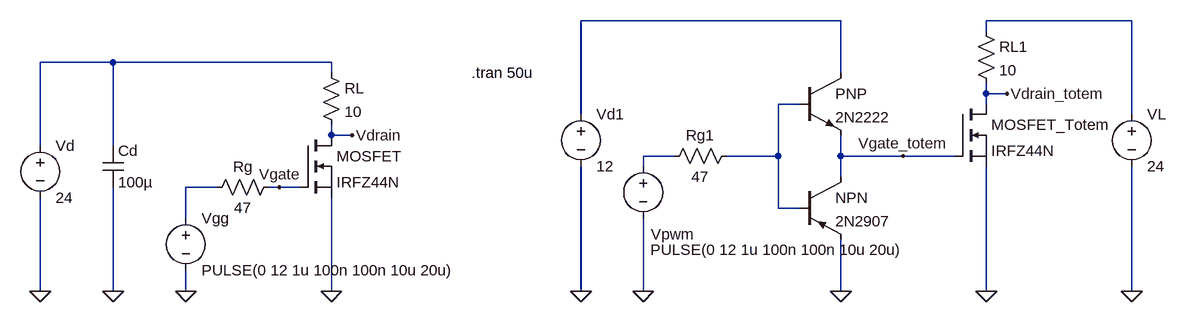
[diagram p0: schematic Prima Nafisman_493817_Task_1.asc]
Prima Nafisman_493817_Task_1.asc, the LTspice schematic file:
Version 4
SHEET 1 6624 680
WIRE 1008 -64 608 -64
WIRE 1456 -64 1232 -64
WIRE 1232 -48 1232 -64
WIRE -112 0 -224 0
WIRE 224 0 -112 0
WIRE 224 16 224 0
WIRE 1008 16 1008 -64
WIRE 1232 48 1232 32
WIRE 1264 48 1232 48
WIRE 944 64 912 64
WIRE 1232 64 1232 48
WIRE 608 80 608 -64
WIRE 1456 80 1456 -64
WIRE 224 112 224 96
WIRE 256 112 224 112
WIRE -224 128 -224 0
WIRE -112 128 -112 0
WIRE 752 144 704 144
WIRE 912 144 912 64
WIRE 912 144 832 144
WIRE 1008 144 1008 112
WIRE 1104 144 1008 144
WIRE 1184 144 1104 144
WIRE 704 160 704 144
WIRE 1008 176 1008 144
WIRE 48 192 0 192
WIRE 144 192 128 192
WIRE 176 192 144 192
WIRE 912 224 912 144
WIRE 944 224 912 224
WIRE 0 240 0 192
WIRE -224 352 -224 208
WIRE -112 352 -112 192
WIRE 0 352 0 320
WIRE 224 352 224 208
WIRE 608 352 608 160
WIRE 704 352 704 240
WIRE 1008 352 1008 272
WIRE 1232 352 1232 160
WIRE 1456 352 1456 160
FLAG 224 352 0
FLAG 0 352 0
FLAG -112 352 0
FLAG -224 352 0
FLAG 144 192 Vgate
FLAG 256 112 Vdrain
FLAG 1456 352 0
FLAG 1232 352 0
FLAG 1008 352 0
FLAG 704 352 0
FLAG 608 352 0
FLAG 1104 144 Vgate_totem
FLAG 1264 48 Vdrain_totem
SYMBOL nmos 176 112 R0
SYMATTR InstName MOSFET
SYMATTR Value IRFZ44N
SYMBOL voltage -224 112 R0
WINDOW 123 0 0 Left 0
WINDOW 39 0 0 Left 0
SYMATTR InstName Vd
SYMATTR Value 24
SYMBOL voltage 0 224 R0
WINDOW 123 0 0 Left 0
WINDOW 39 0 0 Left 0
SYMATTR InstName Vgg
SYMATTR Value PULSE(0 12 1u 100n 100n 10u 20u)
SYMBOL res 144 176 R90
WINDOW 0 0 56 VBottom 2
WINDOW 3 32 56 VTop 2
SYMATTR InstName Rg
SYMATTR Value 47
SYMBOL res 208 0 R0
SYMATTR InstName RL
SYMATTR Value 10
SYMBOL cap -128 128 R0
SYMATTR InstName Cd
SYMATTR Value 100µ
SYMBOL npn 944 16 R0
SYMATTR InstName PNP
SYMATTR Value 2N2222
SYMBOL pnp 944 176 R0
SYMATTR InstName NPN
SYMATTR Value 2N2907
SYMBOL nmos 1184 64 R0
SYMATTR InstName MOSFET_Totem
SYMATTR Value IRFZ44N
SYMBOL res 848 128 R90
WINDOW 0 0 56 VBottom 2
WINDOW 3 32 56 VTop 2
SYMATTR InstName Rg1
SYMATTR Value 47
SYMBOL res 1216 -64 R0
SYMATTR InstName RL1
SYMATTR Value 10
SYMBOL voltage 704 144 R0
WINDOW 0 12 120 Left 2
WINDOW 3 11 144 Left 2
WINDOW 123 0 0 Left 0
WINDOW 39 0 0 Left 0
SYMATTR InstName Vpwm
SYMATTR Value PULSE(0 12 1u 100n 100n 10u 20u)
SYMBOL voltage 608 64 R0
WINDOW 123 0 0 Left 0
WINDOW 39 0 0 Left 0
SYMATTR InstName Vd1
SYMATTR Value 12
SYMBOL voltage 1456 64 R0
WINDOW 123 0 0 Left 0
WINDOW 39 0 0 Left 0
SYMATTR InstName VL
SYMATTR Value 24
TEXT 440 16 Left 2 !.tran 50u

The netlist it stands for:
* Prima Nafisman_493817_Task_1.asc
MOSFET Vdrain Vgate 0 0 IRFZ44N
Vd N003 0 24
Vgg N006 0 PULSE(0 12 1u 100n 100n 10u 20u)
Rg Vgate N006 47
RL N003 Vdrain 10
Cd N003 0 100µ
Q§PNP N001 N004 Vgate_totem 0 2N2222
Q§NPN Vgate_totem N004 0 0 2N2907
MOSFET_Totem Vdrain_totem Vgate_totem 0 0 IRFZ44N
Rg1 N004 N005 47
RL1 N002 Vdrain_totem 10
Vpwm N005 0 PULSE(0 12 1u 100n 100n 10u 20u)
Vd1 N001 0 12
VL N002 0 24
.model NPN NPN
.model PNP PNP
.lib standard.bjt
.model NMOS NMOS
.model PMOS PMOS
.lib standard.mos
.tran 50u
.backanno
.end

* Results of the author's LTspice run, read from the files saved beside the schematic
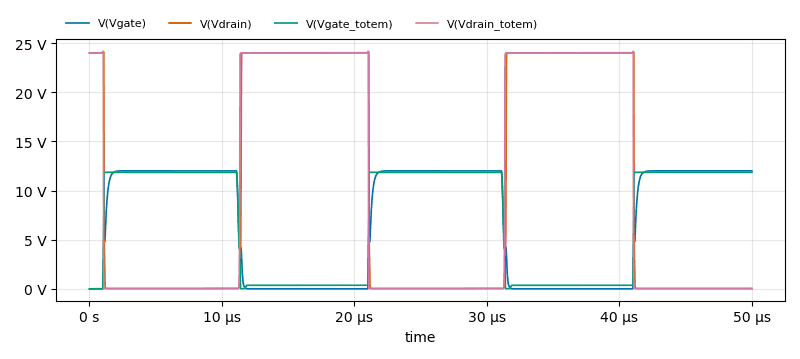
[diagram p1: Transient Analysis of Prima Nafisman_493817_Task_1.asc, plotted from the saved traces]
* Transient Analysis, 1 run:
*   V(Vgate): min 0 V, max 12 V, average 6.953 V, rms 9.057 V, last 12 V
*   V(Vdrain): min 27.74 mV, max 24.09 V, average 9.837 V, rms 15.33 V, last 27.77 mV
*   V(Vgate_totem): min 3.786 mV, max 11.88 V, average 7.087 V, rms 9.057 V, last 11.85 V
*   V(Vdrain_totem): min 28.05 mV, max 24.17 V, average 9.851 V, rms 15.35 V, last 28.08 mV